# Altium schematic sheet VESC_KS75600_ana.SchDoc
size A2; SheetNumber: 1; SheetTotal: 6
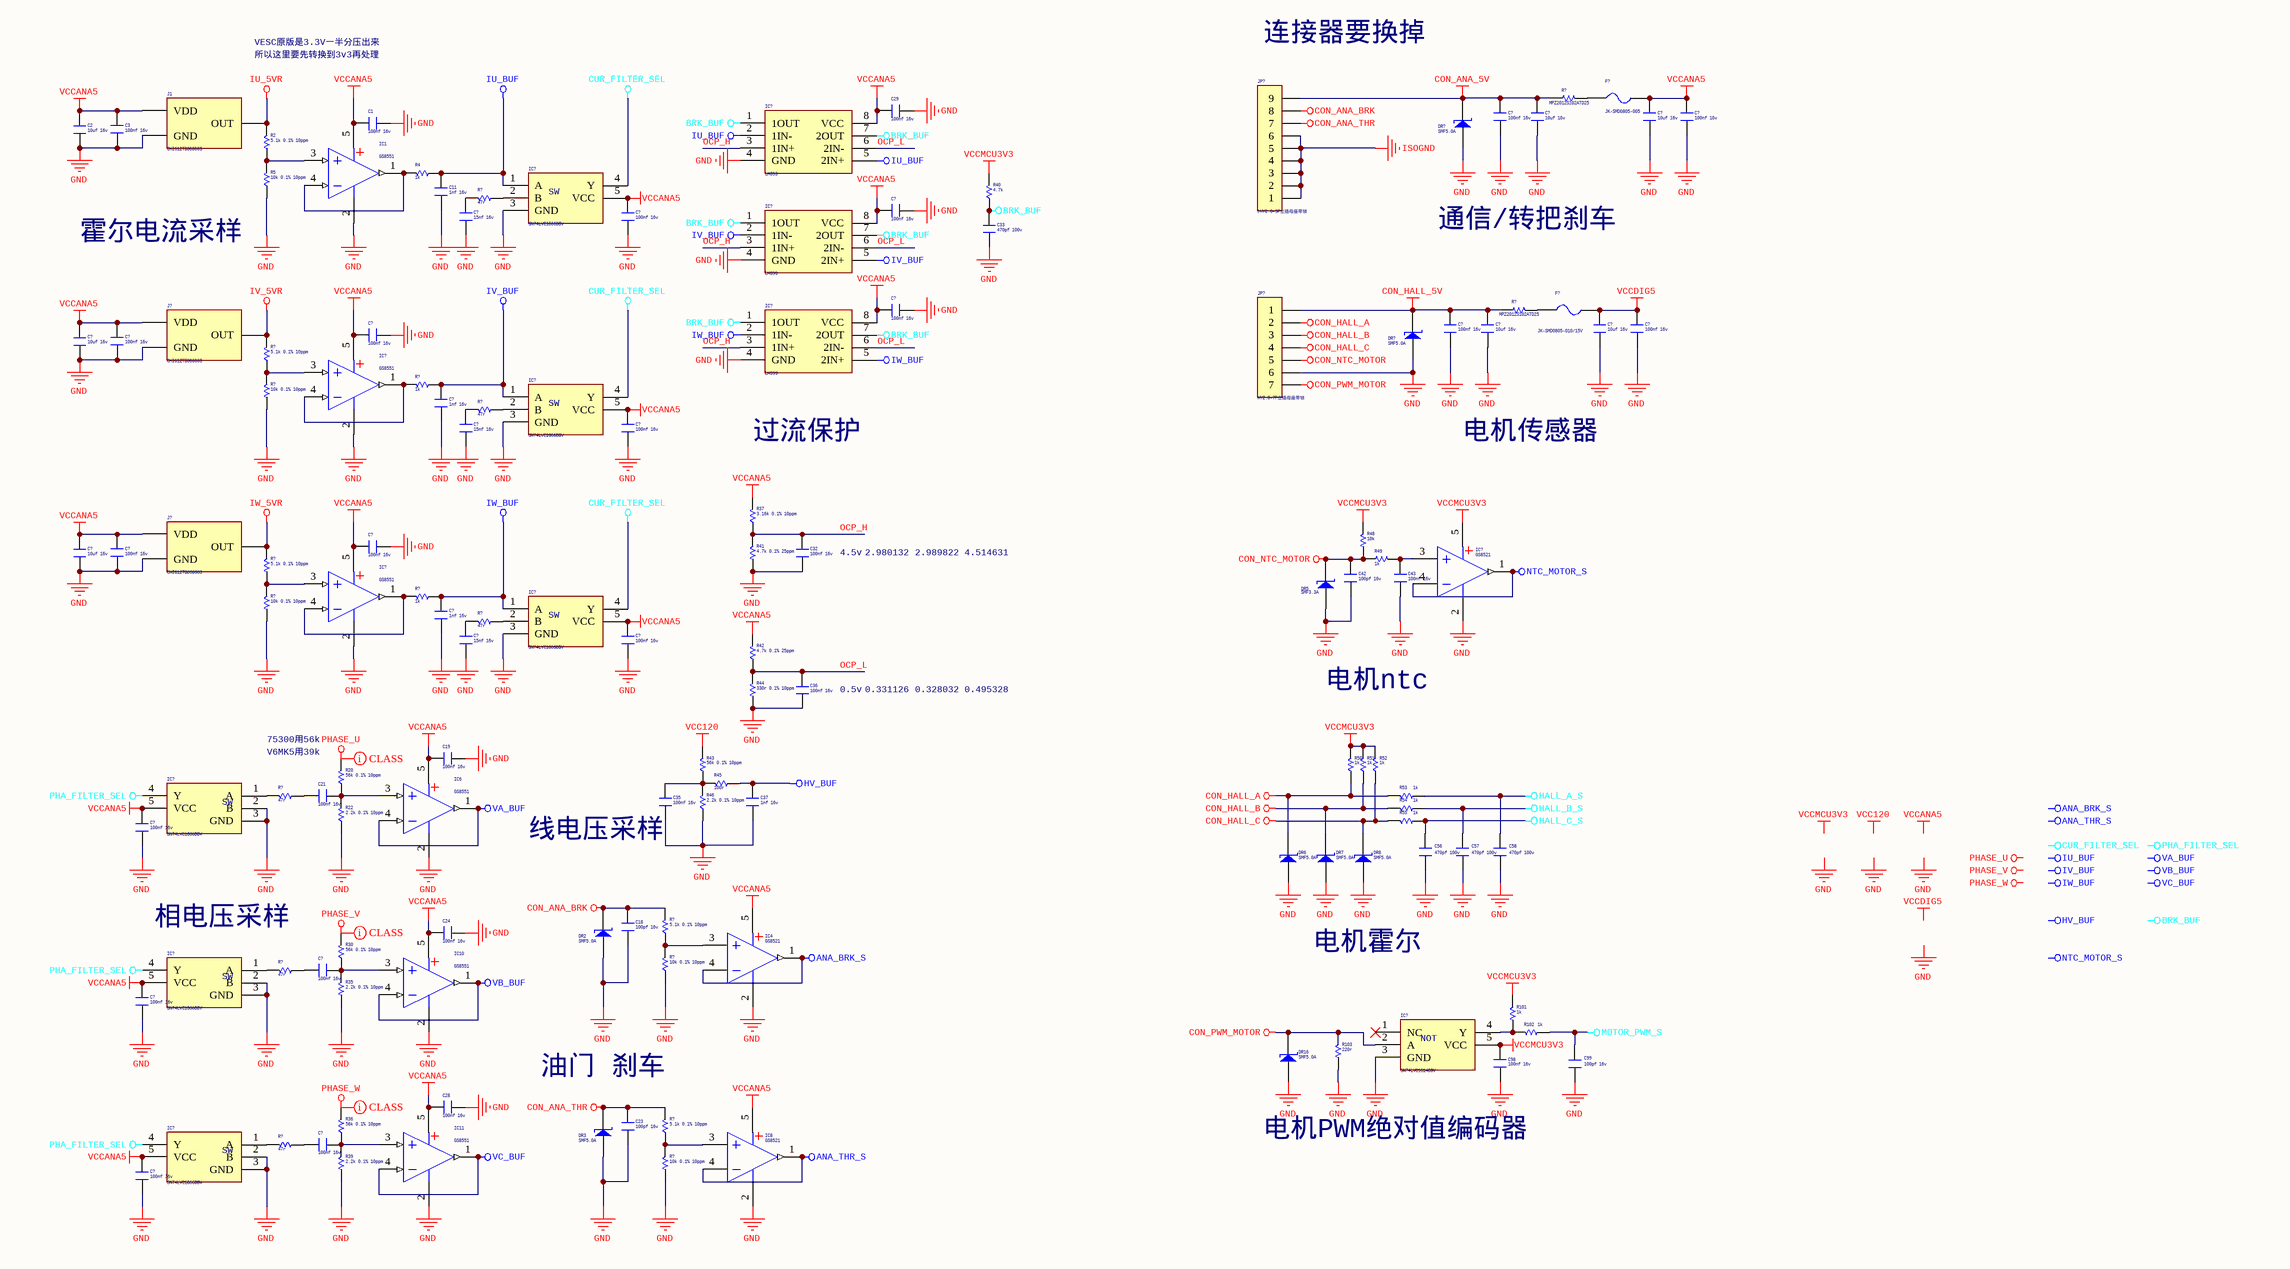
[diagram p0: VESC_KS75600_ana.SchDoc]

## Parts
(Parts that share a designator on the sheet are numbered #1, #2 ... from top to bottom, then left to right.)
C1  100nf 16v  [C 0603]
C2  10uf 16v  [C 0805]
C3  100nf 16v  [C 0603]
C11  1nf 16v  [C 0603]
C18  100pf 16v  [C 0603]
C19  100nf 16v  [C 0603]
C21  100nf 16v  [C 0805]
C23  100pf 16v  [C 0603]
C24  100nf 16v  [C 0603]
C28  100nf 16v  [C 0603]
C29  100nf 16v  [C 0603]
C32  100nf 16v  [C 0603]
C33  470pf 100v  [C 0805]
C35  100nf 16v  [C 0805]
C36  100nf 16v  [C 0603]
C37  1nf 16v  [C 0603]
C42  100pf 16v  [C 0603]
C43  100nf 16v  [C 0603]
C56  470pf 100v  [C 0805]
C57  470pf 100v  [C 0805]
C58  470pf 100v  [C 0805]
C98  100nf 16v  [C 0603]
C99  100pf 16v  [C 0805]
C?#1  100nf 16v  [C 0603]
C?#2  10uf 16v  [C 0805]
C?#3  10uf 16v  [C 0805]
C?#4  100nf 16v  [C 0603]
C?#5  15nf 16v  [C 0603]
C?#6  100nf 16v  [C 0603]
C?#7  100nf 16v  [C 0603]
C?#8  100nf 16v  [C 0603]
C?#9  100nf 16v  [C 0603]
C?#10  10uf 16v  [C 0805]
C?#11  10uf 16v  [C 0805]
C?#12  100nf 16v  [C 0603]
C?#13  100nf 16v  [C 0603]
C?#14  100nf 16v  [C 0603]
C?#15  10uf 16v  [C 0805]
C?#16  1nf 16v  [C 0603]
C?#17  15nf 16v  [C 0603]
C?#18  100nf 16v  [C 0603]
C?#19  100nf 16v  [C 0603]
C?#20  100nf 16v  [C 0603]
C?#21  10uf 16v  [C 0805]
C?#22  1nf 16v  [C 0603]
C?#23  15nf 16v  [C 0603]
C?#24  100nf 16v  [C 0603]
C?#25  100nf 16v  [C 0603]
C?#26  100nf 16v  [C 0805]
C?#27  100nf 16v  [C 0603]
C?#28  100nf 16v  [C 0805]
C?#29  100nf 16v  [C 0603]
DR2  SMF5.0A  [SOD-123F]
DR3  SMF5.0A  [SOD-123F]
DR5  SMF3.3A  [SOD-123F]
DR6  SMF5.0A  [SOD-123F]
DR7  SMF5.0A  [SOD-123F]
DR8  SMF5.0A  [SOD-123F]
DR16  SMF5.0A  [SOD-123F]
DR?#1  SMF5.0A  [SOD-123F]
DR?#2  SMF5.0A  [SOD-123F]
F?#1  JK-SMD0805-005  [FU 0805]
F?#2  JK-SMD0805-010/15V  [FU 0805]
IC1  GS8551  [SOT23-5L]
IC4  GS8521  [SOT23-5N]
IC6  GS8551  [SOT23-5L]
IC8  GS8521  [SOT23-5N]
IC10  GS8551  [SOT23-5L]
IC11  GS8551  [SOT23-5L]
IC?#1  LM393  [SOP8_N]
IC?#2  SN74LVC1G66DBV  [SOT23-5N]
IC?#3  LM393  [SOP8_N]
IC?#4  LM393  [SOP8_N]
IC?#5  GS8551  [SOT23-5L]
IC?#6  SN74LVC1G66DBV  [SOT23-5N]
IC?#7  GS8521  [SOT23-5N]
IC?#8  GS8551  [SOT23-5L]
IC?#9  SN74LVC1G66DBV  [SOT23-5N]
IC?#10  SN74LVC1G66DBV  [SOT23-5N]
IC?#11  SN74LVC1G66DBV  [SOT23-5N]
IC?#12  SN74LVC1G14DBV  [SOT23-5N]
IC?#13  SN74LVC1G66DBV  [SOT23-5N]
J1  CHI612TB00800S  [TO92S+6mm气隙 26硅钢环]
J?#1  CHI612TB00800S  [TO92S+6mm气隙 26硅钢环]
J?#2  CHI612TB00800S  [TO92S+6mm气隙 26硅钢环]
JP?#1  HY2.0-9P立插母座带锁  [PH2.0 D-L-9P]
JP?#2  HY2.0-7P立插母座带锁  [PH2.0 D-L-7P]
R2  5.1k 0.1% 10ppm  [R 0603-HP]
R4  1k  [R 0603]
R5  10k 0.1% 10ppm  [R 0603-HP]
R20  56k 0.1% 10ppm  [R 0805-HP]
R22  2.2k 0.1% 10ppm  [R 0603-HP]
R30  56k 0.1% 10ppm  [R 0805-HP]
R35  2.2k 0.1% 10ppm  [R 0603-HP]
R36  56k 0.1% 10ppm  [R 0805-HP]
R37  3.16k 0.1% 10ppm  [R 0603-HP]
R39  2.2k 0.1% 10ppm  [R 0603-HP]
R40  4.7k  [R 0603]
R41  4.7k 0.1% 25ppm  [R 0603-HP]
R42  4.7k 0.1% 25ppm  [R 0603-HP]
R43  56k 0.1% 10ppm  [R 0805-HP]
R44  330r 0.1% 10ppm  [R 0603-HP]
R45  100r  [R 0603]
R46  2.2k 0.1% 10ppm  [R 0603-HP]
R48  10k  [R 0603]
R49  1k  [R 0603]
R50  1k  [R 0603]
R51  1k  [R 0603]
R52  1k  [R 0603]
R53  1k  [R 0603]
R54  1k  [R 0603]
R55  1k  [R 0603]
R101  1k  [R 0603]
R102  1k  [R 0603]
R103  220r  [R 0603]
R?#1  MPZ2012S102ATD25  [R 0805]
R?#2  47r  [R 0603]
R?#3  MPZ2012S102ATD25  [R 0805]
R?#4  5.1k 0.1% 10ppm  [R 0603-HP]
R?#5  1k  [R 0603]
R?#6  10k 0.1% 10ppm  [R 0603-HP]
R?#7  47r  [R 0603]
R?#8  5.1k 0.1% 10ppm  [R 0603-HP]
R?#9  1k  [R 0603]
R?#10  10k 0.1% 10ppm  [R 0603-HP]
R?#11  47r  [R 0603]
R?#12  47r  [R 0603]
R?#13  5.1k 0.1% 10ppm  [R 0603-HP]
R?#14  47r  [R 0603]
R?#15  10k 0.1% 10ppm  [R 0603-HP]
R?#16  47r  [R 0603]
R?#17  5.1k 0.1% 10ppm  [R 0603-HP]
R?#18  10k 0.1% 10ppm  [R 0603-HP]

## Nets
ANA_BRK_S: IC4.1(OUT) IC4.4(IN-)
ANA_THR_S: IC8.1(OUT) IC8.4(IN-)
BRK_BUF: C33.1 IC?#1.1(1OUT) IC?#1.7(2OUT) IC?#3.1(1OUT) IC?#3.7(2OUT) IC?#4.1(1OUT) IC?#4.7(2OUT) R40.1
CON_ANA_5V: C?#1.1 C?#2.1 DR?#1.2(K) JP?#1.9 R?#1.1
CON_ANA_BRK: C18.2 DR2.2(K) JP?#1.8 R?#13.2
CON_ANA_THR: C23.2 DR3.2(K) JP?#1.7 R?#17.2
CON_HALL_5V: C?#9.1 C?#10.1 DR?#2.2(K) JP?#2.1 R?#3.1
CON_HALL_A: DR6.2(K) JP?#2.2 R50.1 R53.2
CON_HALL_B: DR7.2(K) JP?#2.3 R51.1 R54.2
CON_HALL_C: DR8.2(K) JP?#2.4 R52.1 R55.2
CON_NTC_MOTOR: C42.2 DR5.2(K) JP?#2.5 R48.1 R49.1
CON_PWM_MOTOR: DR16.2(K) IC?#12.2(A) JP?#2.7 R103.2
CUR_FILTER_SEL: IC?#2.4(Y) IC?#6.4(Y) IC?#9.4(Y)
GND: C1.2 C2.1 C3.2 C11.2 C18.1 C19.2 C23.1 C24.2 C28.2 C29.2 C32.1 C33.2 C35.2 C36.1 C37.2 C42.1 C43.1 C56.1 C57.1 C58.1 C98.2 C99.1 C?#1.2 C?#2.2 C?#3.2 C?#4.2 C?#5.2 C?#6.2 C?#7.2 C?#8.2 C?#9.2 C?#10.2 C?#11.2 C?#12.2 C?#13.2 C?#14.2 C?#15.1 C?#16.2 C?#17.2 C?#18.2 C?#19.2 C?#20.2 C?#21.1 C?#22.2 C?#23.2 C?#24.2 C?#25.2 C?#27.2 C?#29.2 DR2.1(A) DR3.1(A) DR5.1(A) DR6.1(A) DR7.1(A) DR8.1(A) DR16.1(A) DR?#1.1(A) DR?#2.1(A) IC1.2(V-) IC4.2(V-) IC6.2(V-) IC8.2(V-) IC10.2(V-) IC11.2(V-) IC?#1.4(GND) IC?#2.3(GND) IC?#3.4(GND) IC?#4.4(GND) IC?#5.2(V-) IC?#6.3(GND) IC?#7.2(V-) IC?#8.2(V-) IC?#9.3(GND) IC?#10.2(B) IC?#10.3(GND) IC?#11.2(B) IC?#11.3(GND) IC?#12.3(GND) IC?#13.2(B) IC?#13.3(GND) J1.2(GND) J?#1.2(GND) J?#2.2(GND) JP?#2.6 R5.1 R22.1 R35.1 R39.1 R41.1 R44.1 R46.1 R103.1 R?#6.1 R?#10.1 R?#15.1 R?#18.1
HALL_A_S: C58.2 R53.1
HALL_B_S: C57.2 R54.1
HALL_C_S: C56.2 R55.1
HV_BUF: C37.1 R45.1
ISOGND: JP?#1.1 JP?#1.2 JP?#1.3 JP?#1.4 JP?#1.5 JP?#1.6
IU_5VR: J1.3(OUT) R2.2
IU_BUF: C11.1 IC?#1.2(1IN-) IC?#1.5(2IN+) IC?#2.1(A) R4.1
IV_5VR: J?#1.3(OUT) R?#4.2
IV_BUF: C?#16.1 IC?#3.2(1IN-) IC?#3.5(2IN+) IC?#6.1(A) R?#5.1
IW_5VR: J?#2.3(OUT) R?#8.2
IW_BUF: C?#22.1 IC?#4.2(1IN-) IC?#4.5(2IN+) IC?#9.1(A) R?#9.1
MOTOR_PWM_S: C99.2 R102.1
NTC_MOTOR_S: IC?#7.1(OUT) IC?#7.4(IN-)
PHA_FILTER_SEL: IC?#10.4(Y) IC?#11.4(Y) IC?#13.4(Y)
PHASE_U: R20.2
PHASE_V: R30.2
PHASE_W: R36.2
VA_BUF: IC6.1(OUT) IC6.4(IN-)
VB_BUF: IC10.1(OUT) IC10.4(IN-)
VC_BUF: IC11.1(OUT) IC11.4(IN-)
VCC120: R43.2
VCCANA5: C1.1 C2.2 C3.1 C19.1 C24.1 C28.1 C29.1 C?#3.1 C?#4.1 C?#6.1 C?#7.1 C?#8.1 C?#13.1 C?#14.1 C?#15.2 C?#18.1 C?#19.1 C?#20.1 C?#21.2 C?#24.1 C?#25.1 C?#27.1 C?#29.1 F?#1.1 IC1.5(V+) IC4.5(V+) IC6.5(V+) IC8.5(V+) IC10.5(V+) IC11.5(V+) IC?#1.8(VCC) IC?#2.5(VCC) IC?#3.8(VCC) IC?#4.8(VCC) IC?#5.5(V+) IC?#6.5(VCC) IC?#8.5(V+) IC?#9.5(VCC) IC?#10.5(VCC) IC?#11.5(VCC) IC?#13.5(VCC) J1.1(VDD) J?#1.1(VDD) J?#2.1(VDD) R37.2 R42.2
VCCDIG5: C?#11.1 C?#12.1 F?#2.1
VCCMCU3V3: C98.1 IC?#7.5(V+) IC?#12.5(VCC) R40.2 R48.2 R50.2 R51.2 R52.2 R101.2
OCP_H: C32.2 IC?#1.3(1IN+) IC?#3.3(1IN+) IC?#4.3(1IN+) R37.1 R41.2
OCP_L: C36.2 IC?#1.6(2IN-) IC?#3.6(2IN-) IC?#4.6(2IN-) R42.1 R44.2
NetC21_1: C21.1 R?#12.1
NetC21_2: C21.2 IC6.3(IN+) R20.1 R22.2
NetC35_1: C35.1 R43.1 R45.2 R46.2
NetC43_2: C43.2 IC?#7.3(IN+) R49.2
NetC?#5_1: C?#5.1 R?#2.2
NetC?#17_1: C?#17.1 R?#7.2
NetC?#23_1: C?#23.1 R?#11.2
NetC?#26_1: C?#26.1 R?#14.1
NetC?#26_2: C?#26.2 IC10.3(IN+) R30.1 R35.2
NetC?#28_1: C?#28.1 R?#16.1
NetC?#28_2: C?#28.2 IC11.3(IN+) R36.1 R39.2
NetF?#1_2: F?#1.2 R?#1.2
NetF?#2_2: F?#2.2 R?#3.2
NetIC1_1: IC1.1(OUT) IC1.4(IN-) R4.2
NetIC1_3: IC1.3(IN+) R2.1 R5.2
NetIC4_3: IC4.3(IN+) R?#13.1 R?#15.2
NetIC8_3: IC8.3(IN+) R?#17.1 R?#18.2
NetIC?#2_2: IC?#2.2(B) R?#2.1
NetIC?#5_1: IC?#5.1(OUT) IC?#5.4(IN-) R?#5.2
NetIC?#5_3: IC?#5.3(IN+) R?#4.1 R?#6.2
NetIC?#6_2: IC?#6.2(B) R?#7.1
NetIC?#8_1: IC?#8.1(OUT) IC?#8.4(IN-) R?#9.2
NetIC?#8_3: IC?#8.3(IN+) R?#8.1 R?#10.2
NetIC?#9_2: IC?#9.2(B) R?#11.1
NetIC?#10_1: IC?#10.1(A) R?#12.2
NetIC?#11_1: IC?#11.1(A) R?#14.2
NetIC?#12_4: IC?#12.4(Y) R101.1 R102.2
NetIC?#13_1: IC?#13.1(A) R?#16.2

Not connected (* = marked no-connect by the designer): IC?#12 1(NC)*

## Layout directives
net class 相线: PHASE_U, PHASE_V, PHASE_W

## Notes on the sheet
- VESC原版是3.3V一半分压出来
- 所以这里要先转换到3v3再处理
- 连接器要换掉
- 霍尔电流采样
- 通信/转把刹车
- 过流保护
- 电机传感器
- (near C32) 4.5v
- 2.980132
- 2.989822
- 4.514631
- (near C36) 0.5v
- 0.331126
- 0.328032
- 0.495328
- 电机ntc
- 75300用56k
- V6MK5用39k
- 线电压采样
- (near IC?#11) 相电压采样
- 电机霍尔
- 油门 刹车
- 电机PWM绝对值编码器
- Labels drawn without touching a wire or pin: ANA_BRK_S, ANA_THR_S, BRK_BUF, CUR_FILTER_SEL, GND, HV_BUF, IU_BUF, IV_BUF, IW_BUF, NTC_MOTOR_S, PHA_FILTER_SEL, PHASE_U, PHASE_V, PHASE_W, VA_BUF, VB_BUF, VC_BUF, VCC120, VCCANA5, VCCDIG5, VCCMCU3V3
- (in symbol SN74LVC1G14) NOT
- (in symbol SN74LVC1G66) SW

## Library data of the parts
C1-C3 C11 C18 C19 C21 C23 C24 C28 C29 C32 C33 C35-C37 C42 C43 C56-C58 C98 C99 C?#1-C?#29 = C: 无极性贴片电容
  C1 C3 C19 C21 C24 C28 C29 C32 C35 C36 C43 C98 C?#1 C?#4 C?#6-C?#9 C?#12-C?#14 C?#18-C?#20 C?#24-C?#29: Voltage: 16v; Value: 100nf
  C2 C?#2 C?#3 C?#10 C?#11 C?#15 C?#21: Voltage: 16v; Value: 10uf
  C11 C37 C?#16 C?#22: Voltage: 16v; Value: 1nf
  C18 C23 C42 C99: Voltage: 16v; Value: 100pf
  C33 C56-C58: Voltage: 100v; Value: 470pf
  C?#5 C?#17 C?#23: Voltage: 16v; Value: 15nf
DR2 DR3 DR5-DR8 DR16 DR?#1 DR?#2 = DR_S: 瞬态电压抑制二极管(单向)
F?#1 F?#2 = FU: 贴片保险丝
IC1 IC4 IC6 IC8 IC10 IC11 IC?#5 IC?#7 IC?#8 = GS8331: 单运放 SOT23-5
IC?#1 IC?#3 IC?#4 = LM393_A: 双路电压比较
IC?#2 IC?#6 IC?#9-IC?#11 IC?#13 = SN74LVC1G66: 单路常开模拟开关 0.5ns 5.5Ω
IC?#12 = SN74LVC1G14: 单路施密特触发反向器
J1 J?#1 J?#2 = CHI612TB: CHI612 三脚 线性霍尔传感器
JP?#1 = Header 9: 9P接插件
JP?#2 = Header 7: 7P接插件
R2 R4 R5 R20 R22 R30 R35-R37 R39-R46 R48-R55 R101 R102 R?#1-R?#18 = R: 贴片电阻
  R2 R?#4 R?#8 R?#13 R?#17: Value: 5.1k 0.1% 10ppm
  R4 R49-R55 R101 R102 R?#5 R?#9: Value: 1k
  R5 R?#6 R?#10 R?#15 R?#18: Value: 10k 0.1% 10ppm
  R20 R30 R36 R43: Value: 56k 0.1% 10ppm
  R22 R35 R39 R46: Value: 2.2k 0.1% 10ppm
  R37: Value: 3.16k 0.1% 10ppm
  R40: Value: 4.7k
  R41 R42: Value: 4.7k 0.1% 25ppm
  R44: Value: 330r 0.1% 10ppm
  R45: Value: 100r
  R48: Value: 10k
  R?#1 R?#3: Value: MPZ2012S102ATD25
  R?#2 R?#7 R?#11 R?#12 R?#14 R?#16: Value: 47r
R103 = R: 贴片电阻; Value: 1k